# Altium schematic sheet CPU.SchDoc
size A
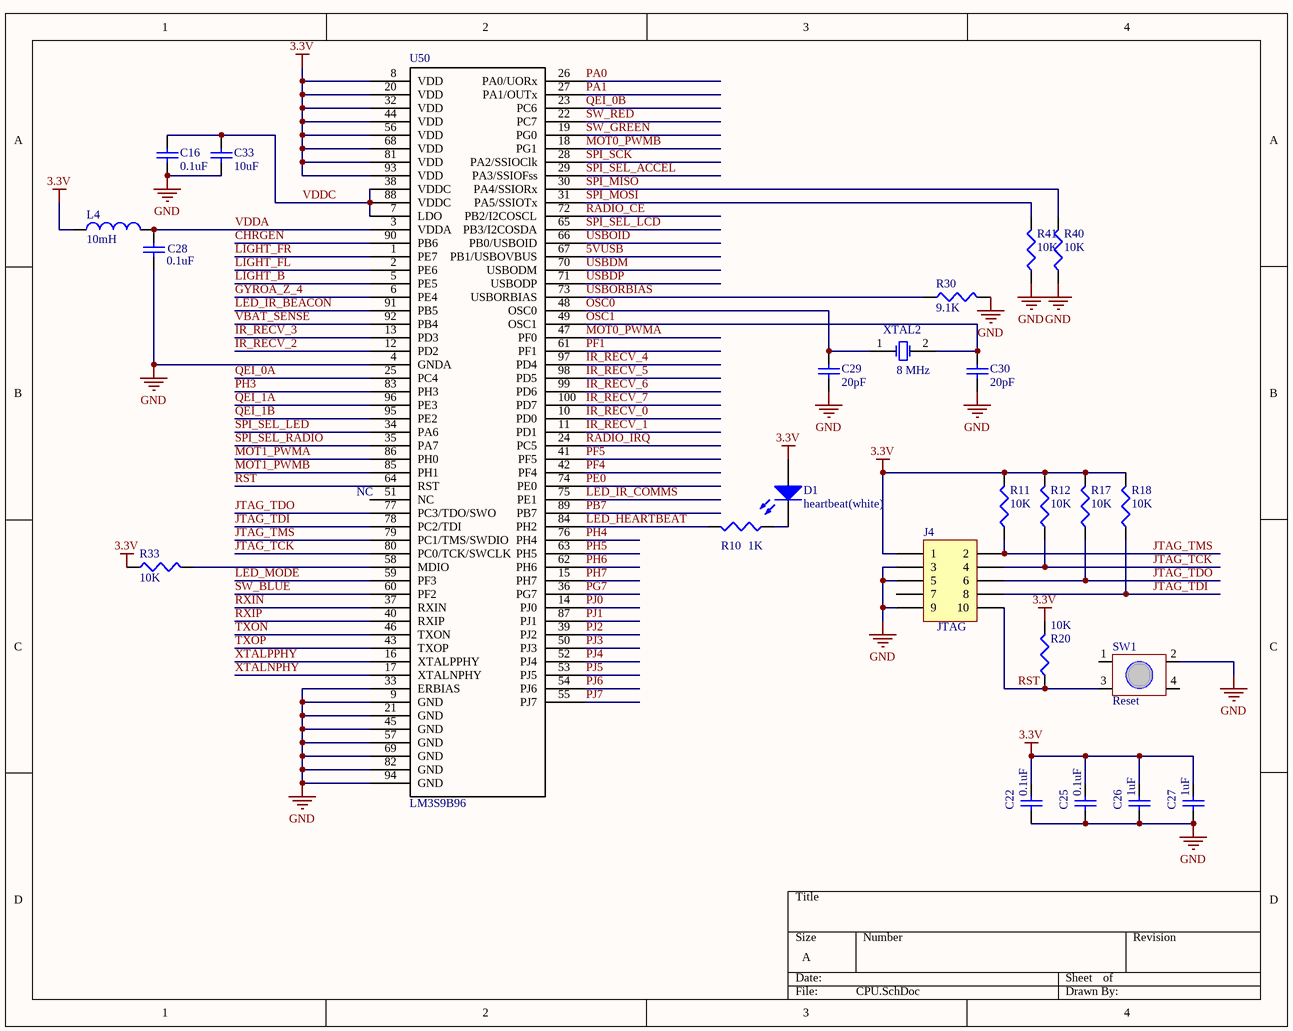
[diagram p0: CPU.SchDoc]

## Parts
C16  value 0.1uF  [CAPC1005L]  (hidden comment: Cap Semi)
C22  value 0.1uF  [CAPC1005L]  (hidden comment: Cap Semi)
C25  value 0.1uF  [CAPC1005L]  (hidden comment: Cap Semi)
C26  value 1uF  [CAPC1608L]  (hidden comment: Cap Semi)
C27  value 1uF  [CAPC1608L]  (hidden comment: Cap Semi)
C28  value 0.1uF  [CAPC1005L]  (hidden comment: Cap Semi)
C29  value 20pF  [CAPC1005L]  (hidden comment: Cap Semi)
C30  value 20pF  [CAPC1005L]  (hidden comment: Cap Semi)
C33  value 10uF  [CAPC1005L]  (hidden comment: Cap Semi)
D1  heartbeat(white)  [INDC2012L]
J4  JTAG  [JTAG-10]
L4  value 10mH  [INDC2012L]  (hidden comment: Inductor)
R10  value 1K  [RESC1608L]  (hidden comment: Res3)
R11  value 10K  [RESC1608L]  (hidden comment: Res3)
R12  value 10K  [RESC1608L]  (hidden comment: Res3)
R17  value 10K  [RESC1608L]  (hidden comment: Res3)
R18  value 10K  [RESC1608L]  (hidden comment: Res3)
R20  value 10K  [RESC1608L]  (hidden comment: Res3)
R30  value 9.1K  [RESC1608L]  (hidden comment: Res3)
R33  value 10K  [RESC1608L]  (hidden comment: Res3)
R40  value 10K  [RESC1608L]  (hidden comment: Res3)
R41  value 10K  [RESC1608L]  (hidden comment: Res3)
SW1  Reset  [SwitchTall-TL330]
U50  LM3S9B96  [LQFP-100]
XTAL2  8 MHz  [RESC5025L]

## Nets
3.3V: C22.2 C25.2 C26.2 C27.2 D1.1(A) J4.1 L4.1 R11.2 R12.2 R17.2 R18.2 R20.2 R33.1 U50.8(VDD) U50.20(VDD) U50.32(VDD) U50.44(VDD) U50.56(VDD) U50.68(VDD) U50.81(VDD) U50.93(VDD)
GND: C16.1 C22.1 C25.1 C26.1 C27.1 C28.1 C29.1 C30.1 C33.1 J4.3 J4.5 J4.9 R30.2 R40.1 R41.1 SW1.2 U50.4(GNDA) U50.9(GND) U50.21(GND) U50.33(ERBIAS) U50.45(GND) U50.57(GND) U50.69(GND) U50.82(GND) U50.94(GND)
5VUSB: U50.67(PB1/USBOVBUS)
CHRGEN: U50.90(PB6)
GYROA_Z_4: U50.6(PE4)
IR_RECV_0: U50.10(PD0)
IR_RECV_1: U50.11(PD1)
IR_RECV_2: U50.12(PD2)
IR_RECV_3: U50.13(PD3)
IR_RECV_4: U50.97(PD4)
IR_RECV_5: U50.98(PD5)
IR_RECV_6: U50.99(PD6)
IR_RECV_7: U50.100(PD7)
JTAG_TCK: J4.4 R12.1 U50.80(PC0/TCK/SWCLK)
JTAG_TDI: J4.8 R18.1 U50.78(PC2/TDI)
JTAG_TDO: J4.6 R17.1 U50.77(PC3/TDO/SWO)
JTAG_TMS: J4.2 R11.1 U50.79(PC1/TMS/SWDIO)
LED_HEARTBEAT: R10.2 U50.84(PH2)
LED_IR_BEACON: U50.91(PB5)
LED_IR_COMMS: U50.75(PE1)
LED_MODE: U50.59(PF3)
LIGHT_B: U50.5(PE5)
LIGHT_FL: U50.2(PE6)
LIGHT_FR: U50.1(PE7)
MOT0_PWMA: U50.47(PF0)
MOT0_PWMB: U50.18(PG1)
MOT1_PWMA: U50.86(PH0)
MOT1_PWMB: U50.85(PH1)
OSC0: C29.2 U50.48(OSC0) XTAL2.1(OSC1)
OSC1: C30.2 U50.49(OSC1) XTAL2.2(OSC2)
PA0: U50.26(PA0/UORx)
PA1: U50.27(PA1/OUTx)
PB7: U50.89(PB7)
PE0: U50.74(PE0)
PF1: U50.61(PF1)
PF4: U50.42(PF4)
PF5: U50.41(PF5)
PG7: U50.36(PG7)
PH3: U50.83(PH3)
PH4: U50.76(PH4)
PH5: U50.63(PH5)
PH6: U50.62(PH6)
PH7: U50.15(PH7)
PJ0: U50.14(PJ0)
PJ1: U50.87(PJ1)
PJ2: U50.39(PJ2)
PJ3: U50.50(PJ3)
PJ4: U50.52(PJ4)
PJ5: U50.53(PJ5)
PJ6: U50.54(PJ6)
PJ7: U50.55(PJ7)
QEI_0A: U50.25(PC4)
QEI_0B: U50.23(PC6)
QEI_1A: U50.96(PE3)
QEI_1B: U50.95(PE2)
RADIO_CE: U50.72(PB2/I2COSCL)
RADIO_IRQ: U50.24(PC5)
RST: J4.10 R20.1 SW1.3 U50.64(RST)
RXIN: U50.37(RXIN)
RXIP: U50.40(RXIP)
SPI_MISO: R40.2 U50.30(PA4/SSIORx)
SPI_MOSI: R41.2 U50.31(PA5/SSIOTx)
SPI_SCK: U50.28(PA2/SSIOClk)
SPI_SEL_ACCEL: U50.29(PA3/SSIOFss)
SPI_SEL_LCD: U50.65(PB3/I2COSDA)
SPI_SEL_LED: U50.34(PA6)
SPI_SEL_RADIO: U50.35(PA7)
SW_BLUE: U50.60(PF2)
SW_GREEN: U50.19(PG0)
SW_RED: U50.22(PC7)
TXON: U50.46(TXON)
TXOP: U50.43(TXOP)
USBDM: U50.70(USBODM)
USBDP: U50.71(USBODP)
USBOID: U50.66(PB0/USBOID)
USBORBIAS: R30.1 U50.73(USBORBIAS)
VBAT_SENSE: U50.92(PB4)
VDDA: C28.2 L4.2 U50.3(VDDA)
VDDC: C16.2 C33.2 U50.7(LDO) U50.38(VDDC) U50.88(VDDC)
XTALNPHY: U50.17(XTALNPHY)
XTALPPHY: U50.16(XTALPPHY)
NetD1_2: D1.2(K) R10.1
NetR33_2: R33.2 U50.58(MDIO)

Not connected (* = marked no-connect by the designer): J4 7; SW1 1 4; U50 51(NC)

## Notes on the sheet
- (near U50) NC

## Library data of the parts
C16 C22 C25-C30 C33 = Cap Semi: Capacitor (Semiconductor SIM Model); Published: 8-Jun-2000; LatestRevisionDate: 29-May-2009; LatestRevisionNote: IPC-7351 Footprint Added.; PackageReference: C1206; Publisher: Altium Limited; PackageDescription: Chip Capacitor
D1 = LED2: Typical RED, GREEN, YELLOW, AMBER GaAs LED; Published: 8-Jun-2000; LatestRevisionDate: 17-Jul-2002; LatestRevisionNote: Re-released for DXP Platform.; PackageVersion: Feb-2002; PackageReference: 3.2X1.6X1.1; Publisher: Altium Limited
J4 = Header 5X2H: Header, 5-Pin, Dual row, Right Angle; LatestRevisionDate: 17-Jul-2002; LatestRevisionNote: Re-released for DXP Platform.; Publisher: Altium Limited
L4 = Inductor: Code_IEC: 1005; Published: 8-Jun-2000; LatestRevisionDate: 29-May-2009; LatestRevisionNote: IPC-7351 Footprint Added.; PackageReference: 0402-A; Publisher: Altium Limited; PackageDescription: Chip Inductor; Code_JEITA: 0402
R10-R12 R17 R18 R20 R30 R33 R40 R41 = Res3: Resistor; Published: 8-Jun-2000; LatestRevisionDate: 29-May-2009; LatestRevisionNote: IPC-7351 Footprint Added.; PackageReference: J1-0603; Publisher: Altium Limited; PackageDescription: Chip Resistor
SW1 = Switch-TL330
XTAL2 = XTAL: Crystal Oscillator; Published: 8-Jun-2000; LatestRevisionDate: 17-Jul-2002; LatestRevisionNote: Re-released for DXP Platform.; PackageReference: R38; Publisher: Altium Limited